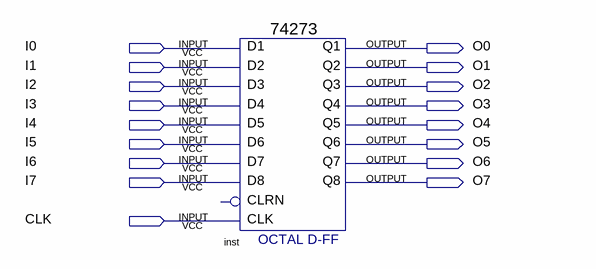
[diagram p0: schematic sheet]
// Quartus schematic Scheme.bdf as structural Verilog: 1 symbols, 17 pins
module Scheme (
  input  I0,
  input  I1,
  input  I2,
  input  I3,
  input  I4,
  input  I5,
  input  I6,
  input  I7,
  input  CLK,
  output O0,
  output O1,
  output O2,
  output O3,
  output O4,
  output O5,
  output O6,
  output O7
);

  \74273  inst (
    .D2(I1), .D3(I2), .D1(I0), .D4(I3), .D7(I6), .D6(I5), .D5(I4), .D8(I7), .CLK(CLK), .Q4(O3), .Q1(O0),
    .Q2(O1), .Q3(O2), .Q6(O5), .Q5(O4), .Q7(O6), .Q8(O7));  // open: CLRN
endmodule
